# EAGLE schematic 5_TTY (EAGLE 7.6.0)
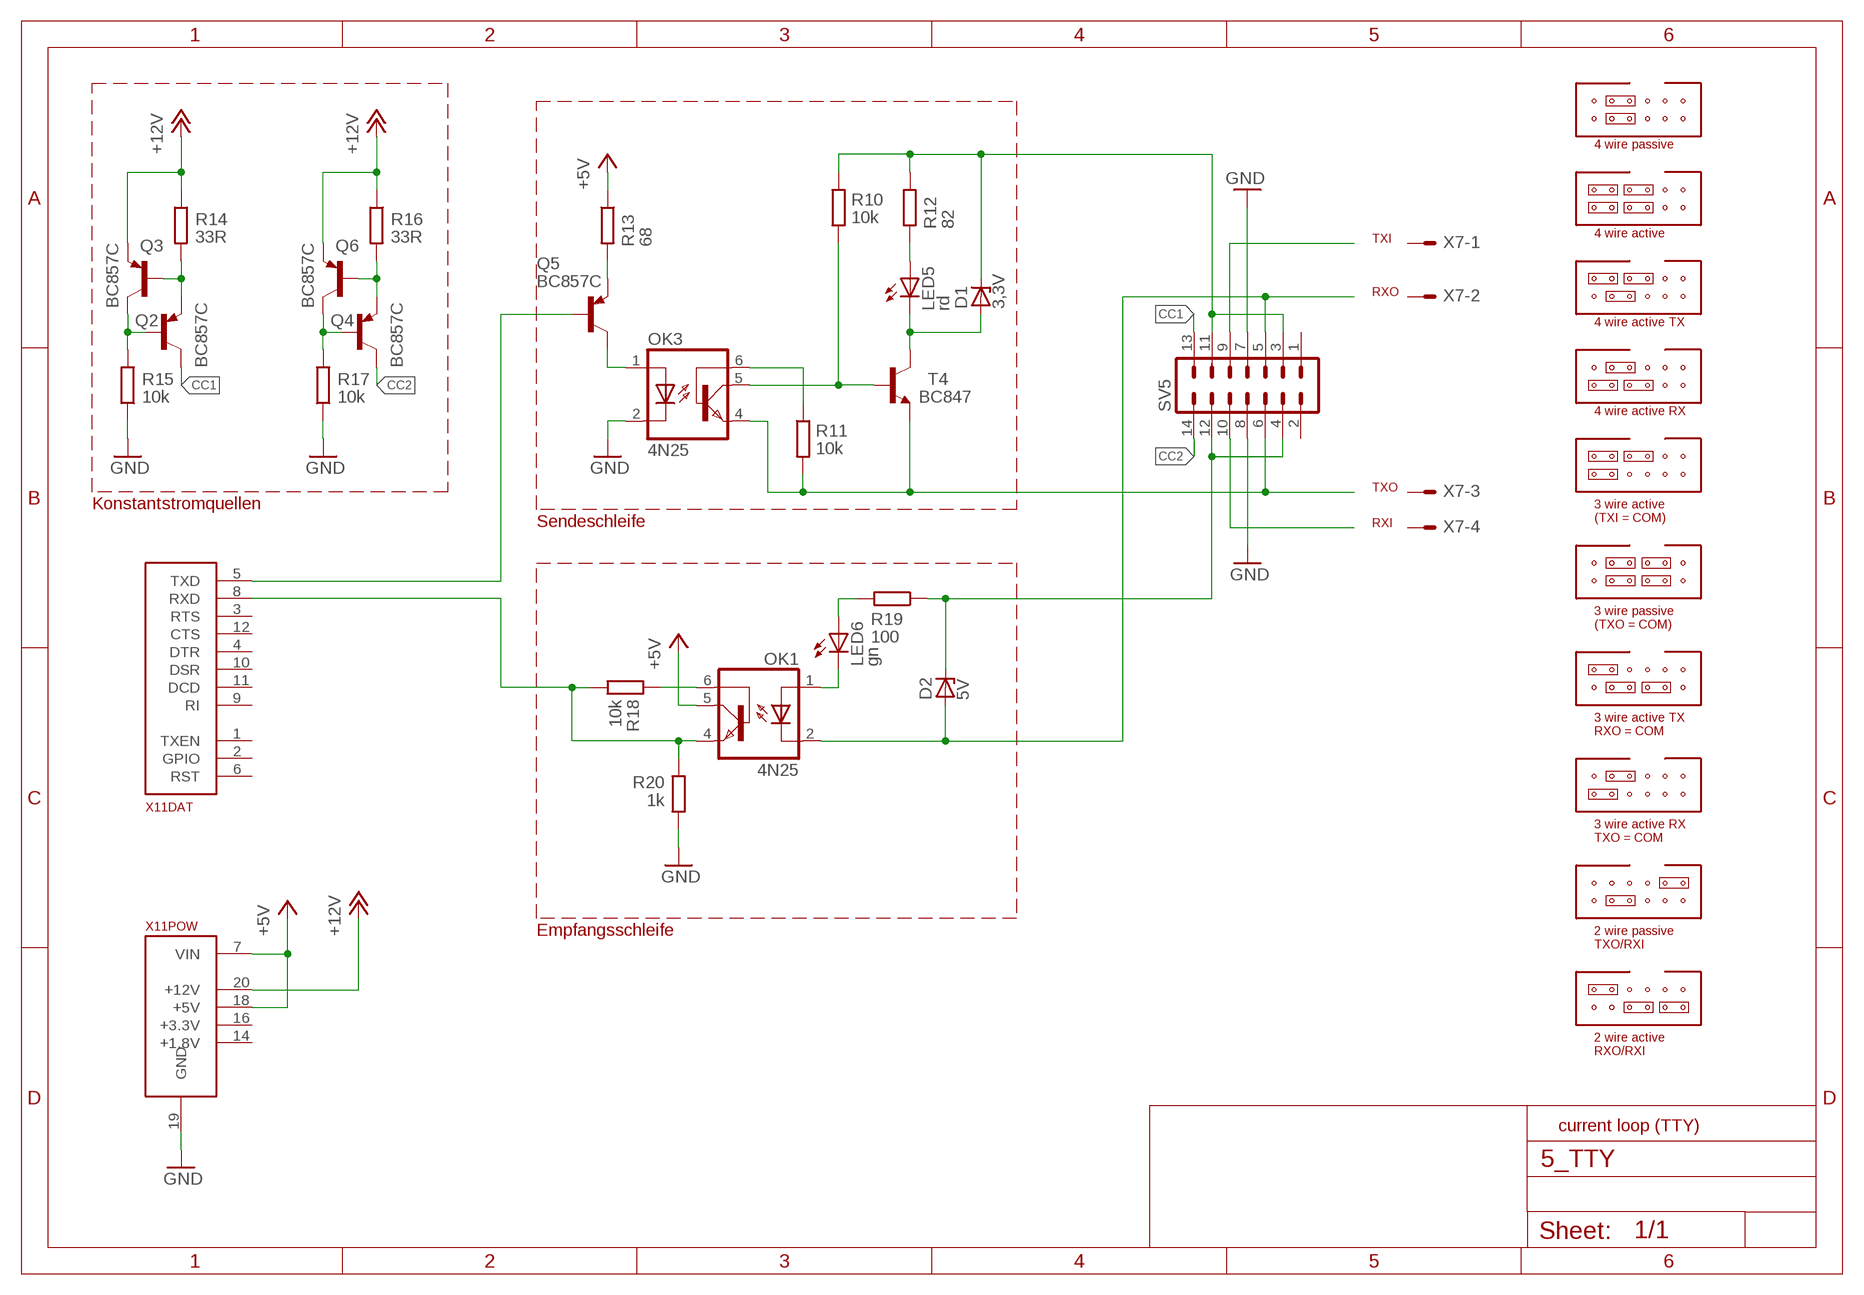
[diagram p0: schematic, sheet 1]

## Parts
D1  3,3V  ZENER-DIODESOT23  [SOT23]
D2  5V  ZENER-DIODESOT23  [SOT23]
LED5  rd  LEDCHIPLED_0603  [CHIPLED_0603]
LED6  gn  LEDCHIPLED_0603  [CHIPLED_0603]
OK1  4N25  4N35  [DIL06]
OK3  4N25  4N35  [DIL06]
Q2  BC857C  BC857CSMD  [SOT23-BEC]
Q3  BC857C  BC857CSMD  [SOT23-BEC]
Q4  BC857C  BC857CSMD  [SOT23-BEC]
Q5  BC857C  BC857CSMD  [SOT23-BEC]
Q6  BC857C  BC857CSMD  [SOT23-BEC]
R10  10k  R-EU_R0805  [R0805]
R11  10k  R-EU_R0805  [R0805]
R12  82  R-EU_R0805  [R0805]
R13  68  R-EU_R0805  [R0805]
R14  33R  R-EU_R0805  [R0805]
R15  10k  R-EU_R0805  [R0805]
R16  33R  R-EU_R0805  [R0805]
R17  10k  R-EU_R0805  [R0805]
R18  10k  R-EU_R0805  [R0805]
R19  100  R-EU_R0805  [R0805]
R20  1k  R-EU_R0805  [R0805]
SV5  ML14L  [ML14L]
T4  BC847  [SOT23]
X7  AKL18X-04W  [AKL182-04]
X11  ALLSERIALD  [DAUGHTER-THT]

## Nets
+5V: OK1.5(COL) R13.1 X11.7(POW:VIN) X11.18(POW:+5V)
+12V: Q3.E Q6.E R14.1 R16.1 X11.20(POW:+12V)
CC1: Q2.C SV5.13
CC2: Q4.C SV5.14
GND: OK3.2(C) R15.1 R17.1 R20.1 SV5.7 SV5.8 X11.19(POW:GND)
N$44: SV5.9
N$45: Q4.B Q6.C R17.2
N$46: OK1.4(EMI) R18.2 R20.2 X11.8(DAT:RXD)
N$49: Q4.E Q6.B R16.2
N$54: OK3.6(BAS) R11.1
N$55: OK3.5(COL) R10.2 T4.1(B)
N$56: D1.1(A) LED5.C T4.3(C)
N$57: Q2.B Q3.C R15.2
N$58: LED5.A R12.2
N$59: Q2.E Q3.B R14.2
N$60: OK3.1(A) Q5.C
N$61: Q5.E R13.2
N$62: OK1.6(BAS) R18.1
N$63: LED6.C OK1.1(A)
N$64: LED6.A R19.2
N$65: SV5.10
N$91: Q5.B X11.5(DAT:TXD)
RXN: D2.1(A) OK1.2(C) SV5.5
RXP: D2.3(C) R19.1 SV5.4 SV5.12
TXN: OK3.4(EMI) R11.2 SV5.6 T4.2(E)
TXP: D1.3(C) R10.1 R12.1 SV5.3 SV5.11
Unconnected: SV5.1 SV5.2 X7.P$1 X7.P$2 X7.P$3 X7.P$4 X11.1(DAT:TXEN) X11.2(DAT:GPIO) X11.3(DAT:RTS) X11.4(DAT:DTR) X11.6(DAT:RST) X11.9(DAT:RI) X11.10(DAT:DSR) X11.11(DAT:DCD) X11.12(DAT:CTS) X11.14(POW:+1.8V) X11.16(POW:+3.3V)

## Notes on the sheet
- 4 wire passive
- 4 wire active
- TXI
- RXO
- 4 wire active TX
- 4 wire active RX
- TXO
- Konstantstromquellen
- 3 wire active
  (TXI = COM)
- Sendeschleife | RXI
- 3 wire passive
  (TXO = COM)
- 3 wire active TX
  RXO = COM
- 3 wire active RX
  TXO = COM
- Empfangsschleife
- 2 wire passive
  TXO/RXI
- 2 wire active
  RXO/RXI
- current loop (TTY)

## Library data of the parts
D1 D2 = diode:ZENER-DIODE: Z-Diode
LED5 LED6 = led:LED: LED OSRAM: - CHIPLED LG R971, LG N971, LY N971, LG Q971, LY Q971, LO R971, LY R971 LH N974, LH R974 LS Q976, LO Q976, LY Q976 LO Q996 - Hyper CHIPLED LW Q18S LB Q993, LB Q99A, LB R99A - SideLED LS A670, LO A670, LY A670, LG A670, LP A670 LB A673, LV A673, LT A673, LW A673 LH A674 LY A675 LS A676, LA A676, LO A676, LY A676, LW A676 LS A679, LY A679, LG A679 - Hyper Micro SIDELED® LS Y876, LA Y876, LO Y876, LY Y876 LT Y87S - SmartLED LW L88C, LW L88S LB L89C, LB L89S, LG L890 LS L89K, LO L89K, LY L89K LS L896, LA L896, LO L896, LY L896 - TOPLED LS T670, LO T670, LY T670, LG T670, LP T670 LSG T670, LSP T670, LSY T670, LOP T670, LYG T670 LG T671, LOG T671, LSG T671 LB T673, LV T673, LT T673, LW T673 LH T674 LS T676, LA T676, LO T676, LY T676, LB T676, LH T676, LSB T676, LW T676 LB T67C, LV T67C, LT T67C, LS T67K, LO T67K, LY T67K, LW E67C LS E67B, LA E67B, LO E67B, LY E67B, LB E67C, LV E67C, LT E67C LW T67C LS T679, LY T679, LG T679 LS T770, LO T770, LY T770, LG T770, LP T770 LB T773, LV T773, LT T773, LW T773 LH T774 LS E675, LA E675, LY E675, LS T675 LS T776, LA T776, LO T776, LY T776, LB T776 LHGB T686 LT T68C, LB T68C - Hyper Mini TOPLED® LB M676 - Mini TOPLED Santana® LG M470 LS M47K, LO M47K, LY M47K Source: http://www.osram.convergy.de LUXEON: - LUMILED® LXK2-PW12-R00, LXK2-PW12-S00, LXK2-PW14-U00, LXK2-PW14-V00 LXK2-PM12-R00, LXK2-PM12-S00, LXK2-PM14-U00 LXK2-PE12-Q00, LXK2-PE12-R00, LXK2-PE12-S00, LXK2-PE14-T00, LXK2-PE14-U00 LXK2-PB12-K00, LXK2-PB12-L00, LXK2-PB12-M00, LXK2-PB14-N00, LXK2-PB14-P00, LXK2-PB14-Q00 LXK2-PR12-L00, LXK2-PR12-M00, LXK2-PR14-Q00, LXK2-PR14-R00 LXK2-PD12-Q00, LXK2-PD12-R00, LXK2-PD12-S00 LXK2-PH12-R00, LXK2-PH12-S00 LXK2-PL12-P00, LXK2-PL12-Q00, LXK2-PL12-R00 Source: www.luxeon.com KINGBRIGHT: KA-3528ASYC Source: www.kingbright.com
OK1 OK3 = optocoupler:4N35: MOTOROLA OPTO COUPLER; FARNELL: 1612454; MF: FAIRCHILD SEMICONDUCTOR; MPN: 4N35; OC_FARNELL: 1328375; OC_NEWARK: 72K9946
Q2-Q6 = transistor-pnp:BC857*: PNP Transistror; FARNELL: 8734771
R10 R11 R18 = resistor:R-EU_: RESISTOR, European symbol; FARNELL: 2498051
R12 R13 R19 = resistor:R-EU_: RESISTOR, European symbol; FARNELL: 2498057
R14 R16 = resistor:R-EU_: RESISTOR, European symbol; FARNELL: 2498090
R15 R17 = resistor:R-EU_: RESISTOR, European symbol; FARNELL: 2502672
R20 = resistor:R-EU_: RESISTOR, European symbol; FARNELL: 2498050
SV5 = con-ml:ML14L: HARTING; OC_FARNELL: unknown; OC_NEWARK: unknown
T4 = transistor:BC847: NPN TRANSISTOR; FARNELL: 1081230
X7 = con-riacon_akl:AKL18X-04: Riacon AKL18X Steckverbinder 4-Pol Grid = 3,5mm
X11 = AllSerial:ALLSERIAL